# Altium project PROFINAL_BASE_DYCDE.PrjPcb
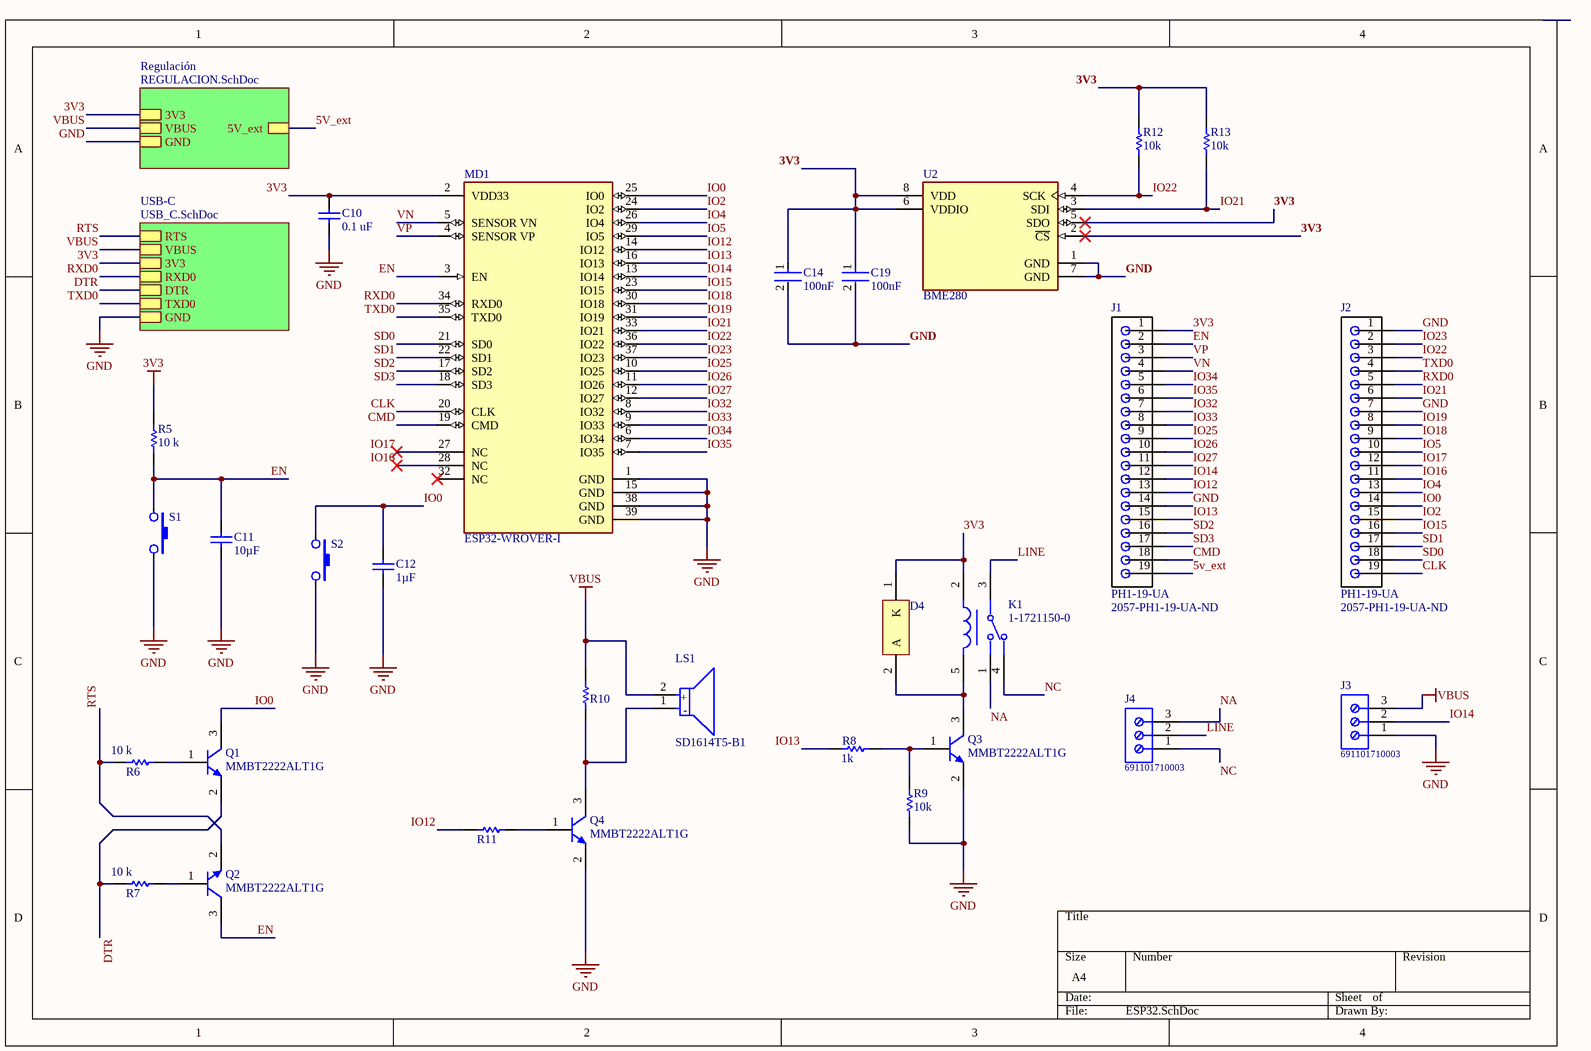
[diagram p0: ESP32.SchDoc]
3 sheets, 48 parts. Net scope: hierarchical (ports join the sheet entries above them; power ports are global).
Board files: PCB_V1.PcbDoc, PCB_v2.PcbDoc
Sheets:
  ESP32.SchDoc
    Regulación = REGULACION.SchDoc
    USB-C = USB_C.SchDoc

## Sheet ESP32.SchDoc
size A4; SheetNumber: 1; SheetTotal: 3

### Parts
C10  0.1 uF  [CAPC2013X94X50ML20T25]
C11  10µF  [CAPC2013X145X50ML20T25]
C12  1µF  [CAPC2013X145X50ML20T25]
C14  100nF  [FP-C0805C-DN-IPC_A]
C19  100nF  [FP-C0805C-DN-IPC_A]
D4  MBR120ESFT1G  [ONSC-SOD-123FL-2-498_V]  (value not drawn)
J1  PH1-19-UA  Supplier Part Number 1: 2057-PH1-19-UA-ND  [PH1-19-UA]
J2  PH1-19-UA  Supplier Part Number 1: 2057-PH1-19-UA-ND  [PH1-19-UA]
J3  691101710003  [691101710003]
J4  691101710003  [691101710003]
K1  1-1721150-0  [FP-1-1721150-0-MFG]
LS1  SD1614T5-B1  [FP-SD1614T5-B1-MFG]
MD1  ESP32-WROVER-I  [FP-ESP32-WROVER-I-MFG]
Q1  MMBT2222ALT1G  [ONSC-SOT-23-3-318-08_V]
Q2  MMBT2222ALT1G  [ONSC-SOT-23-3-318-08_V]
Q3  MMBT2222ALT1G  [ONSC-SOT-23-3-318-08_V]
Q4  MMBT2222ALT1G  [ONSC-SOT-23-3-318-08_V]
R5  10 k  [RESC2013X60X30ML20T20]
R6  10 k  [RESC2013X60X30ML20T20]
R7  10 k  [RESC2013X60X30ML20T20]
R8  1k  [RESC2013X60X30ML20T20]
R9  10k  [RESC2013X60X30ML20T20]
R10  ERJ-P06J102V  [RESC2013X70X40ML20T20]  (value not drawn)
R11  RK73B2ATTD103J  [RESC2013X60X30ML20T20]  (value not drawn)
R12  10k  [RESC2013X60X40ML20T25_A]
R13  10k  [RESC2013X60X40ML20T25_A]
S1  PTS820J25MSMTRLFS  [SMT_SW_PTS_820]  (value not drawn)
S2  IO0  [SMT_SW_PTS_820]  (value not drawn)
U2  BME280  [FP-BME280-MFG]

### Sub-sheets
Regulación = REGULACION.SchDoc: GND, 3V3, VBUS, 5V_ext
USB-C = USB_C.SchDoc: RTS, VBUS, 3V3, RXD0, DTR, TXD0, GND

### Nets
3V3: C10.2 C14.1 C19.1 D4.1(K) J1.1 K1.2 MD1.2(VDD33) R5.2 R12.2 R13.2 U2.2(~{CS}) U2.5(SDO) U2.6(VDDIO) U2.8(VDD) ; sheet Regulación/3V3, sheet USB-C/3V3
GND: C10.1 C11.1 C12.1 C14.2 C19.2 J1.14 J2.1 J2.7 J3.1 MD1.1(GND) MD1.15(GND) MD1.38(GND) MD1.39(GND) Q3.2(E) Q4.2(E) R9.2 S1.2 S2.2 U2.1(GND) U2.7(GND) ; sheet Regulación/GND, sheet USB-C/GND
VBUS: J3.3 LS1.2(A) R10.2 ; sheet Regulación/VBUS, sheet USB-C/VBUS
5v_ext: J1.19 ; sheet Regulación/5V_ext
CLK: J2.19 MD1.20(CLK)
CMD: J1.18 MD1.19(CMD)
DTR: Q1.2(E) R7.2 ; sheet USB-C/DTR
EN: C11.2 J1.2 MD1.3(EN) Q2.3(C) R5.1 S1.1
IO0: C12.2 J2.14 MD1.25(IO0) Q1.3(C) S2.1
IO2: J2.15 MD1.24(IO2)
IO4: J2.13 MD1.26(IO4)
IO5: J2.10 MD1.29(IO5)
IO12: J1.13 MD1.14(IO12) R11.1
IO13: J1.15 MD1.16(IO13) R8.1
IO14: J1.12 J3.2 MD1.13(IO14)
IO15: J2.16 MD1.23(IO15)
IO16: J2.11 MD1.28(NC)
IO17: J2.12 MD1.27(NC)
IO18: J2.9 MD1.30(IO18)
IO19: J2.8 MD1.31(IO19)
IO21: J2.6 MD1.33(IO21) R13.1 U2.3(SDI)
IO22: J2.3 MD1.36(IO22) R12.1 U2.4(SCK)
IO23: J2.2 MD1.37(IO23)
IO25: J1.9 MD1.10(IO25)
IO26: J1.10 MD1.11(IO26)
IO27: J1.11 MD1.12(IO27)
IO32: J1.7 MD1.8(IO32)
IO33: J1.8 MD1.9(IO33)
IO34: J1.5 MD1.6(IO34)
IO35: J1.6 MD1.7(IO35)
LINE: J4.2 K1.3
NA: J4.3 K1.1
NC: J4.1 K1.4
RTS: Q2.2(E) R6.2 ; sheet USB-C/RTS
RXD0: J2.5 MD1.34(RXD0) ; sheet USB-C/RXD0
SD0: J2.18 MD1.21(SD0)
SD1: J2.17 MD1.22(SD1)
SD2: J1.16 MD1.17(SD2)
SD3: J1.17 MD1.18(SD3)
TXD0: J2.4 MD1.35(TXD0) ; sheet USB-C/TXD0
VN: J1.4 MD1.5(SENSOR_VN)
VP: J1.3 MD1.4(SENSOR_VP)
NetD4_2: D4.2(A) K1.5 Q3.3(C)
NetLS1_1: LS1.1(C) Q4.3(C) R10.1
NetQ1_1: Q1.1(B) R6.1
NetQ2_1: Q2.1(B) R7.1
NetQ3_1: Q3.1(B) R8.2 R9.1
NetQ4_1: Q4.1(B) R11.2

Not connected (* = marked no-connect by the designer): MD1 32(NC)*

### Notes on the sheet
- (in symbol CMP-08413-000012-1) +; -

### Library data of the parts
C10 = CMP-2000-05016-1: Chip Capacitor, Ceramic, 0.1 uF, 10%, 50 V, 0805, RoHS, Tape and Reel; Manufacturer: AVX; Rated Voltage: 50V; Capacitance: 100nF; Dielectric: X7R; Case Size/Dimension: 0805; Tolerance (%): ±10%; Datasheet URL: http://www.farnell.com/datasheets/319609.pdf; Datasheet Version: Sep-07; Manufacturer URL: http://www.avx.com/
C11 C12 = CMP-2007-01082-1: 1µF ±10% 16V Ceramic Capacitor X7R 0805 (2012 Metric); Manufacturer: Kemet; Part Number: C0805C105K4RAC7800
C14 C19 = CMP-2007-00279-2: CAP CER 0.1UF 50V X7R 0805; Manufacturer Part Number: C0805C104K5RACTU; Manufacturer: KEMET; Value: 0.10 μF; Tolerance: 0.1; Temperature Coefficient: 30ppm/°C; Material: Ceramic; Device Class L2: Capacitors; Temperature Range Low: -55°C; Voltage Rating: 50 V; Digikey Description: CAP CER 0.1UF 50V X7R 0805; Category: Cap; ComponentLink2Description: Datasheet; Octopart: https://octopart.com/c0805c104k5ractu-kemet-143926; RoHS: TRUE; ComponentLink2URL: https://content.kemet.com/datasheets/KEM_C1003_C0G_SMD.pdf; Temperature Characteristic: X7R; Temperature: -55°C to +125°C; Height: 0.88mm; Temperature Range High: +125°C; Device Class L1: Passive Components; Automotive: No; Lead Free: Yes; Ipc Land Pattern Name: CAPC200125X78; Device Class L3: Ceramic Capacitors; Mouser Description: Cap Ceramic 0.1uF 50V X7R 10% SMD 2.0 x 1.2 mm 125 C Paper T/R; Capacitance: 0.10 μF; Package: C0805C-DN
D4 = CMP-1055-00434-1: Schottky Power Rectifier, 2-Pin SOD-123, Pb-Free, Tape and Reel; Manufacturer: On Semiconductor; Configuration: Single; IFSM Max (A): 40; ComponentLink2URL: http://www.onsemi.cn/pub_link/Collateral/MBR120ESFT1-D.PDF; PackageDescription: 2-Pin SOD, Body 1.65 x 2.7 mm; RoHS: TRUE; ComponentLink1URL: http://www.onsemi.com/; PackageVersion: Rev. D, 05/2013; PartNumber: MBR120ESFT1G; PackageReference: SOD-123FL-2-498; ComponentLink2Description: Datasheet; ComponentLink1Description: Manufacturer URL; DatasheetVersion: Rev. 4; ComponentLink3Description: Package Specification; ComponentLink3URL: http://www.onsemi.com/pub_link/Collateral/498-01.PDF; Mounting Technology: Surface Mount; Packing: Tape and Reel
J1 J2 = PH1-19-UA: Connector Header Through Hole 19 position 0.100" (2.54mm); Supplier 1: Digi-Key
J3 J4 = CMP-1502-03257-1: Series 101 - 5.00 mm Horizontal Entry Modular with Pressure Clamp WR-TBL, 3 pin; Manufacturer: Wurth Elektronik; Pitch: 5.00mm; Pin Number: 3; Publisher: WurthElektronik; Part Number: 691101710003; Operating Temperature: -40to105degC; Package Reference: 691101710003; Packaging: Box; Manufacturer URL: http://www.we-online.de; Datasheet URL: http://katalog.we-online.de/em/datasheet/6911017100xx.pdf; Mounting Technology: THT
K1 = CMP-03395-000112-1: RELAY GEN PURPOSE SPDT 10A 5V; Manufacturer: TE; Coil Power: 360mW; Coil Resistance: 70Ω; Coil Type: Non-Latching; Number Of Contacts: 1; Standoff Height: 0.2mm; Device Class L1: Electromechanical; Device Class L3: Power Relays; Throw Configuration: SPDT; ComponentLink2Description: Datasheet; RoHS: TRUE; Automotive: No; Octopart: https://octopart.com/1-1721150-0-te+connectivity-41294869; Switching Current: 10A; Ambient Temperature Range Low: -30°C; ComponentLink2URL: https://www.te.com/usa-en/product-1-1721150-0.html?te_bu=Cor&te_type=other&te_campaign=oct_glo_cor-oct-global-oth-prtnr-fy19-oct-octo-buy-bom_sma-298_2&elqCampaignId=35216; Package: 1-1721150-0; Height: 16.3mm; Lead Free: Yes; Manufacturer Part Number: 1-1721150-0; Digikey Description: RELAY GEN PURPOSE SPDT 10A 5V; Category: Relay; Ambient Temperature Range High: +70°C; Device Class L2: Relays; Current Rating: 10A; Coil Voltage: 5V
LS1 = CMP-08413-000012-1: AUDIO MAGNETIC XDCR 3-6V TH; Voltage Rating (DC): 5V; Frequency: 2.048kHz; Number of Terminals/Pins: 2; Max Supply Current: 80mA; Self Resonant Frequency: 2.05kHz; Washable: No; Diameter: 16mm; Package Quantity: 480; Min Operating Temperature: -10°C; Termination: PC Pins; Mount: Through Hole; Packaging: Tray; Height: 14mm; Series: SD; Operating Supply Current: 80mA; Operating Supply Voltage: 5V; Max Operating Temperature: 70°C; Number of Pins: 2; Sensing Method: Magnetic
MD1 = CMP-194065-000001-1: SMD MODULE, ESP32-D0WDQ6, 32MBIT; Manufacturer: Espressif; Number Of Adc Channels: 16; Min Supply Voltage: 2.3V; Interface: I2C,SPI,UART,I2S,Other; Max Frequency: 2484MHz; Nominal Supply Current: 500mA; Sensitivity: -98dBm; Max Supply Voltage: 3.6V; Number Of Gpio: 20; Data Rate: 150Mbits/s; Package: ESP32-WROVER-I; Temperature Range Low: -40°C; Temperature Range High: +85°C; Device Class L1: Integrated Circuits (ICs); Category: UNK; ComponentLink2Description: Datasheet; Device Class L2: RF Semiconductors and Devices; Automotive: No; Lead Free: Yes; Octopart: https://octopart.com/esp32-wrover-i-espressif+systems-89171349; ComponentLink2URL: https://www.espressif.com/sites/default/files/documentation/esp32-wrover_datasheet_en.pdf; Temperature: -40°C to +85°C; Height: 3.4mm; RoHS: TRUE; Digikey Description: SMD MODULE, ESP32-D0WDQ6, 32MBIT; Device Class L3: Transceivers; Manufacturer Part Number: ESP32-WROVER-I
Q1-Q4 = CMP-1048-00538-1: General Purpose Transistor, NPN Silicon, 3-Pin SOT-23, Pb-Free, Tape and Reel; Manufacturer: On Semiconductor; fT Min (MHz): 300; IC Continuous (A): 0.6; ComponentLink3URL: http://www.onsemi.cn/pub_link/Collateral/318-08.PDF; PartNumber: MMBT2222ALT1G; RoHS: TRUE; ComponentLink1URL: http://www.onsemi.com/; ComponentLink3Description: Package Specification; ComponentLink2Description: Datasheet; Mounting Technology: Surface Mount; Packing: Tape and Reel; PackageDescription: 3-Pin Small Outline Transistor, Body 2.92 x 1.3 mm, Pitch 0.95 mm; DatasheetVersion: Rev. 10; PackageReference: SOT-23-3-318-08; ComponentLink2URL: http://www.onsemi.cn/pub_link/Collateral/MMBT2222LT1-D.PDF; Polarity: NPN; PackageVersion: Rev. AP, 11/2009; ComponentLink1Description: Manufacturer URL
R5-R9 = CMP-2001-04657-1: 10 kOhms ±5% 0.25W, 1/4W Chip Resistor 0805 (2012 Metric) Automotive AEC-Q200, Moisture Resistant Thick Film; Part Number: RK73B2ATTD103J; Manufacturer: KOA Speer
R10 = CMP-2001-00477-1: RES SMD 1K OHM 5% 1/2W 0805; Manufacturer: Panasonic; Part Number: ERJ-P06J102V
R11 = CMP-2001-04657-1: 10 kOhms ±5% 0.25W, 1/4W Chip Resistor 0805 (2012 Metric) Automotive AEC-Q200, Moisture Resistant Thick Film; Manufacturer: KOA Speer; Part Number: RK73B2ATTD103J
R12 R13 = CMP-2001-00582-2: Metal Film Chip Resistor, High Reliability Type, 0.125 W, +/- 0.1%, -55 to 155 degC, 0805 (2012 Metric), RoHS, Tape and Reel; Voltage Rating: 100V; Power Rating: 125mW(1/8W); Brand: Panasonic; Temperature Coefficient: 25PPM/C; Resistance: 10kOhms; Product Category: ThinFilmResistors-SMD; Datasheet Version: 02/2016; Operating Temperature Range: -55Cto+155C; Length: 2mm; Mounting Technology: SurfaceMount; Manufacturer URL: http://www.panasonic.com/; Width: 1.25mm; Packaging: Reel; Product: ThinFilmResistorsSMD; Package / Case: 0805(2012metric); Termination Style: SMD/SMT; Tolerance: 0.1%; Datasheet URL: https://industrial.panasonic.com/cdbs/www-data/pdf/RDM0000/AOA0000C307.pdf; Package Description: 2-Pin Surface Mount Device, Body 2 x 1.25 mm; Factory Pack Quantity: 5000; Series: ERA-6A; Case Code - mm: 2012; RoHS: Details; Package Reference: 0805; Height: 0.5mm; Manufacturer: Panasonic; Case Code - in: 0805; Type: MetalFilmChipResistors
S2 = PTS820J25MSMTRLFS
U2 = CMP-2000-05073-3: SENSOR PRESSURE HUMIDITY TEMP; Sensor Type: Temperature; Accuracy: 3%; Response Time: 1s; Output Type: SPI; Min Operating Temperature: -40°C; Max Operating Temperature: 85°C; Case/Package: LGA; Packaging: Cut Tape; Mount: Surface Mount; Lead Free: Lead Free; Number of Pins: 8

## Sheet REGULACION.SchDoc
size A4; SheetNumber: 3; SheetTotal: 3
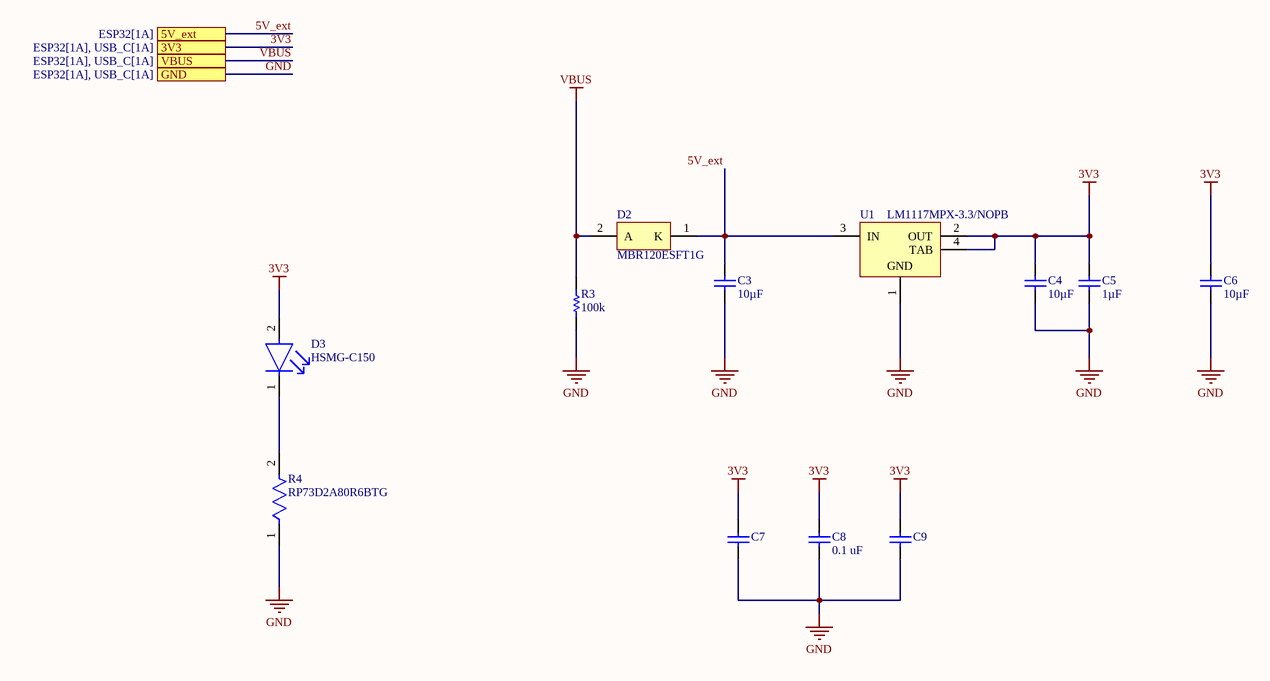
[diagram p1: REGULACION.SchDoc]

### Parts
C3  10µF  [CAPC2013X140X50ML20T25]
C4  10µF  [CAPC2013X140X50ML20T25]
C5  1µF  [CAPC2013X145X50ML20T25]
C6  10µF  [CAPC2013X140X50ML20T25]
C7  C0805C106K4PACTU  [CAPC2013X140X50ML20T25]  (value not drawn)
C8  0.1 uF  [CAPC2013X94X50ML20T25]
C9  C0805C106K4PACTU  [CAPC2013X140X50ML20T25]  (value not drawn)
D2  MBR120ESFT1G  [ONSC-SOD-123FL-2-498_V]
D3  HSMG-C150  [FP-HSMG-C150-MFG]
R3  100k  [RESC2013X60X40ML20T25]
R4  RP73D2A80R6BTG  [FP-RP732A-IPC_A]
U1  LM1117MPX-3.3/NOPB  [DCY0004A_M]

### Ports
3V3 (see ESP32[1A], USB_C[1A]), 5V_ext (see ESP32[1A]), GND (see ESP32[1A], USB_C[1A]), VBUS (see ESP32[1A], USB_C[1A])

### Nets
3V3: C4.2 C5.2 C6.2 C7.2 C8.2 C9.2 D3.2(A) U1.2(OUT) U1.4(TAB) ; port 3V3
GND: C3.1 C4.1 C5.1 C6.1 C7.1 C8.1 C9.1 R3.1 R4.1 U1.1(GND) ; port GND
VBUS: D2.2(A) R3.2 ; port VBUS
5v_ext: C3.2 D2.1(K) U1.3(IN) ; port 5V_ext
NetD3_1: D3.1(C) R4.2

### Library data of the parts
C3 C4 C6 C7 C9 = CMP-2007-03242-1: 10µF ±10% 16V Ceramic Capacitor X5R 0805 (2012 Metric); Part Number: CL21A106KOQNNNG
C5 = CMP-2007-01082-1: as C11 on sheet ESP32
C8 = CMP-2000-05016-1: as C10 on sheet ESP32; Case Size/Dimension: 0805; Tolerance (%): ±10%; Datasheet URL: http://www.farnell.com/datasheets/319609.pdf; Datasheet Version: Sep-07; Manufacturer URL: http://www.avx.com/
D2 = CMP-1055-00434-1: as D4 on sheet ESP32; ComponentLink2URL: http://www.onsemi.cn/pub_link/Collateral/MBR120ESFT1-D.PDF; PackageDescription: 2-Pin SOD, Body 1.65 x 2.7 mm; RoHS: TRUE; ComponentLink1URL: http://www.onsemi.com/; PackageVersion: Rev. D, 05/2013; PartNumber: MBR120ESFT1G; PackageReference: SOD-123FL-2-498; ComponentLink2Description: Datasheet; ComponentLink1Description: Manufacturer URL; DatasheetVersion: Rev. 4; ComponentLink3Description: Package Specification; ComponentLink3URL: http://www.onsemi.com/pub_link/Collateral/498-01.PDF; Mounting Technology: Surface Mount; Packing: Tape and Reel
D3 = CMP-2000-05061-2: LED GREEN DIFFUSED 1206 SMD; Manufacturer: Broadcom; Led Orientation: Top View; Max Junction Temp: +95°C; Peak Emmision Wavelength: 570nm; Viewing Angle: 170°; Wavelength: 572nm; Reverse Voltage: 5V; Luminous Intensity: 15mcd; Forward Voltage: 2.2V; Power Dissipation: 65mW; Forward Current: 20mA; ComponentLink2Description: Datasheet; Lead Free: Yes; Temperature Range Low: -40°C; Package: HSMG-C150; Digikey Description: LED GREEN DIFFUSED 1206 SMD; Mouser Description: LED Uni-Color Green 570nm 2-Pin Chip LED T/R; Manufacturer Part Number: HSMG-C150; Temperature Range High: +85°C; Device Class L1: Optoelectronics; Colour: Green; Category: Diode; Device Class L3: unset; RoHS: TRUE; Height: 1.2mm; ComponentLink2URL: https://docs.broadcom.com/docs/AV02-0551EN; Device Class L2: LEDs; Automotive: No; Ipc Land Pattern Name: DIOCP320160X55; Octopart: https://octopart.com/hsmg-c150-broadcom-71131304; Temperature: -40°C to +85°C
R3 = CMP-2001-00583-1: 100 kOhms ±0.1% 0.125W, 1/8W Chip Resistor 0805 (2012 Metric) Automotive AEC-Q200 Thin Film; Part Number: ERA6AEB104V; Manufacturer: Panasonic
R4 = CMP-03211-002377-1: RESISTOR, 0805 80.6Ω, 0.1% 15ppm/°C; Manufacturer: TE Connectivity; Power Rating: 0.125W; Voltage Rating: 150V; ComponentLink2URL: https://www.te.com/commerce/DocumentDelivery/DDEController?Action=srchrtrv&DocNm=1773272&DocType=DS&DocLang=English; Device Class L3: Chip SMD Resistors; Automotive: No; ComponentLink2Description: Datasheet; Series: RP73; Temperature Coefficient: 15ppm/°C; Octopart: https://octopart.com/rp73d2a80r6btg-te+connectivity-42011633; octopart_url: https://octopart.com/rp73d2a80r6btg-te+connectivity-42011633; Device Class L2: Resistors; Device Class L1: Passive Components; Value: 80.6Ω; Composition: Thin Film; Lead Free: Yes; Ipc Land Pattern Name: RESC200125X55; Resistance: 80.6Ω; Package: RP732A; packaging: 250 cut tape length; Height: 0.65mm; Tolerance: 0.1%; Manufacturer Part Number: RP73D2A80R6BTG; Temperature: -55°C to 155°C; Temperature Range High: 155°C; RoHS: TRUE; Category: Res; Temperature Range Low: -55°C
U1 = CMP-0062-01639-4: 800mA Low-Dropout Linear Regulator, 4-pin SOT-223, Pb-Free; Manufacturer: Texas Instruments; High-Reliability: Y; PowerWise: N; PackageTopMarking: XYTT*N05A; CompType: LDO IC; ComponentLink1URL: http://www.ti.com/general/docs/lit/getliterature.tsp?genericPartNumber=LM1117-N&fileType=pdf; PartNumber: LM1117MPX-3.3/NOPB; ComponentLink1Description: Datasheet URL; PinCount: 4; Code_JEDEC: TO-261-AA; PackageDescription: Molded SOT-223, 6.50 x 3.56 x 1.6mm Body, 4 Lead, 2.3mm Pitch; PackageReference: DCY0004A; RoHS: Y; Code_IPC: SOT223-4

## Sheet USB_C.SchDoc
size A4; SheetNumber: 2; SheetTotal: 3
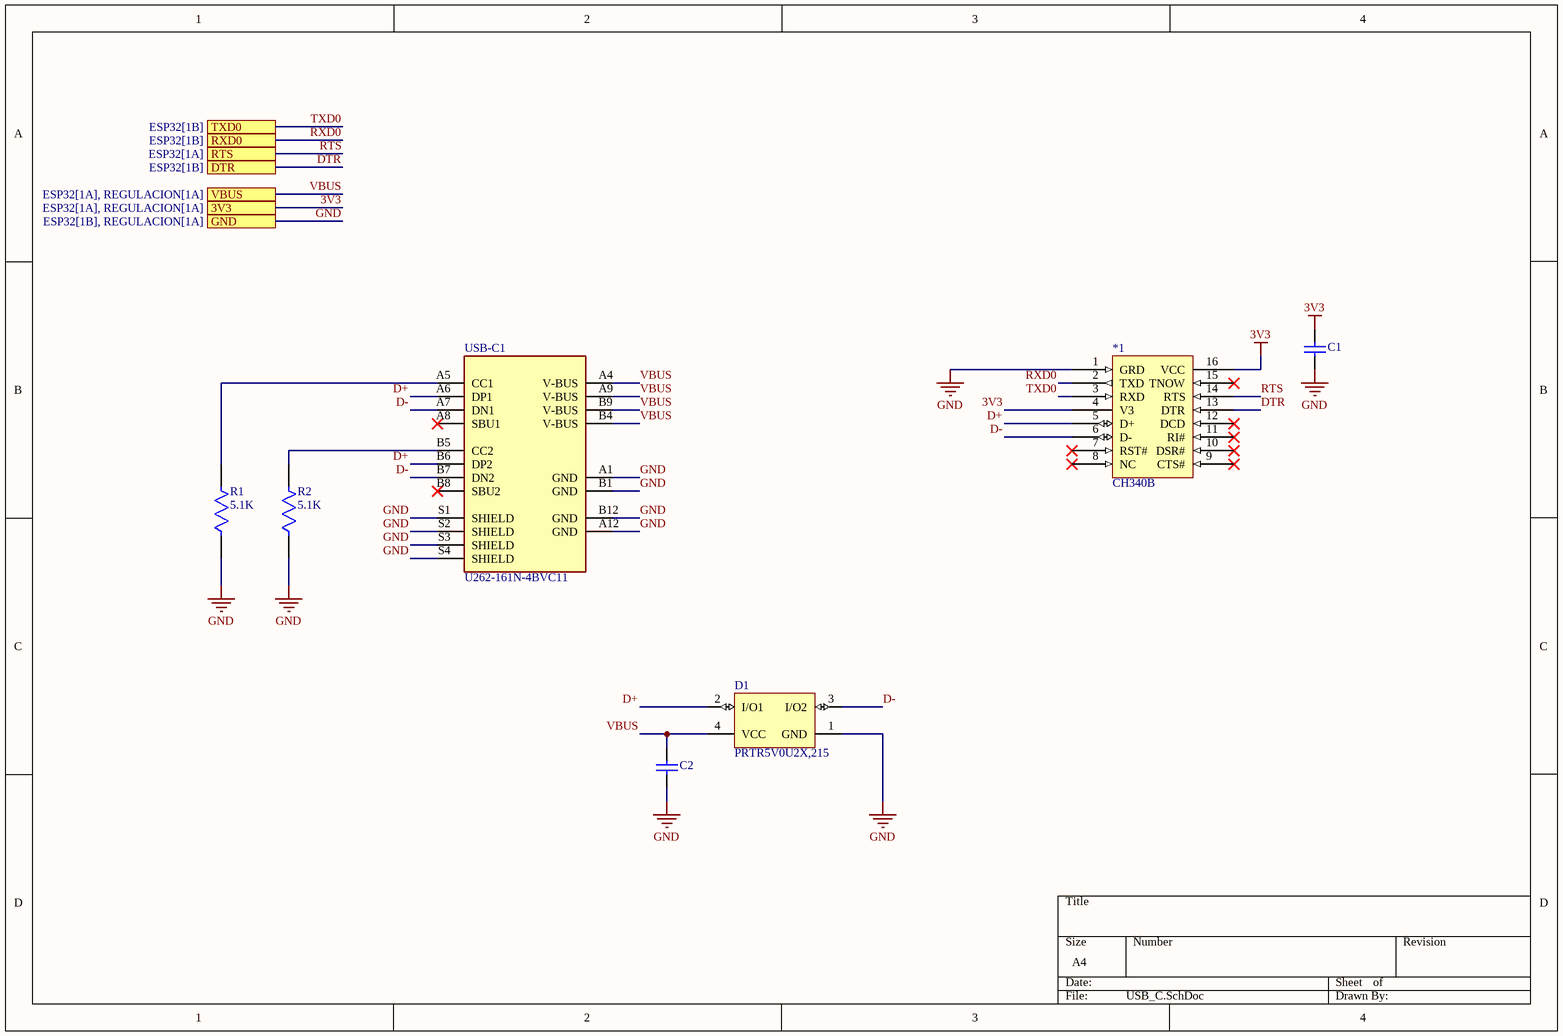
[diagram p2: USB_C.SchDoc]

### Parts
*1  CH340B  [CH340B]
C1  08055C104KAT2A  [CAPC2013X94X50ML20T25]  (value not drawn)
C2  08055C104KAT2A  [CAPC2013X94X50ML20T25]  (value not drawn)
D1  PRTR5V0U2X,215  [NXP-SOT143B-4_V]
R1  5.1K  [FP-CRCW0805-e3-IPC_A]
R2  5.1K  [FP-CRCW0805-e3-IPC_A]
USB-C1  U262-161N-4BVC11  [U262-161N-4BVC11]

### Ports
3V3 (see ESP32[1A], REGULACION[1A]), DTR (see ESP32[1B]), GND (see ESP32[1B], REGULACION[1A]), RTS (see ESP32[1A]), RXD0 (see ESP32[1B]), TXD0 (see ESP32[1B]), VBUS (see ESP32[1A], REGULACION[1A])

### Nets
3V3: *1.4(V3) *1.16(VCC) C1.2 ; port 3V3
GND: *1.1(GRD) C1.1 C2.1 D1.1(GND) R1.1 R2.1 USB-C1.A1(GND) USB-C1.A12(GND) USB-C1.B1(GND) USB-C1.B12(GND) USB-C1.S1(SHIELD) USB-C1.S2(SHIELD) USB-C1.S3(SHIELD) USB-C1.S4(SHIELD) ; port GND
VBUS: C2.2 D1.4(VCC) USB-C1.A4(V-BUS) USB-C1.A9(V-BUS) USB-C1.B4(V-BUS) USB-C1.B9(V-BUS) ; port VBUS
D+: *1.5(D+) D1.2(I/O1) USB-C1.A6(DP1) USB-C1.B6(DP2)
D-: *1.6(D-) D1.3(I/O2) USB-C1.A7(DN1) USB-C1.B7(DN2)
DTR: *1.13(DTR) ; port DTR
RTS: *1.14(RTS) ; port RTS
RXD0: *1.2(TXD) ; port RXD0
TXD0: *1.3(RXD) ; port TXD0
NetR1_2: R1.2 USB-C1.A5(CC1)
NetR2_2: R2.2 USB-C1.B5(CC2)

Not connected (* = marked no-connect by the designer): *1 7(RST#)* 8(NC)* 9(CTS#)* 10(DSR#)* 11(RI#)* 12(DCD)* 15(TNOW)*; USB-C1 A8(SBU1)* B8(SBU2)*

### Library data of the parts
*1 = CH340B: - USB 2.0 Transceiver 2Mbps SOP-16_150mil USB ICs ROHS; ComponentLink1Description: Datasheet; ComponentLink1URL: https://www.mpja.com/download/35227cpdata.pdf
C1 C2 = CMP-2000-05016-1: as C10 on sheet ESP32; Case Size/Dimension: 0805; Tolerance (%): ±10%; Datasheet URL: http://www.farnell.com/datasheets/319609.pdf; Datasheet Version: Sep-07; Manufacturer URL: http://www.avx.com/
D1 = CMP-2000-05285-1: Ultra Low Capacitance Double Rail-to-Rail ESD Protection Diode, 5.5 V, 1 pF, -40 to 85 degC, 4-Pin SOT143B, RoHS, Tape and Reel; Manufacturer: NXP Semiconductors; Capacitance Value: 16pF; Number of Elements: 1; Rad Hardened: No; Reverse Breakdown Voltage: 6V; Working Voltage (Max): 5.5V; Polarity: Uni-Directional; Configuration: Quad; Leakage Current: 0.1uA; Product Height (mm): 1mm; Suppressor Type: DiodeArrays; Product Length (mm): 3mm; Product Depth (mm): 1.4mm; ESD Protection Voltage: 8KV@ContactDisc; Package Type: SOT; Mounting: SurfaceMount; Packaging: TapeandReel; Datasheet Version: Rev. 02, 01/2008; Reverse Stand-off Voltage: 5.5V; Manufacturer URL: http://www.nxp.com/; Operating Temp Range: -40Cto85C; Operating Temperature Classification: Industrial; Working Voltage: 5.5V; Operating Temperature Min Deg. C: -40C; Datasheet URL: https://datasheet.ciiva.com/4479/prtr5v0u2x-102853-4479461.pdf; Leakage Current (Max): 0.1uA; Direction Type: Uni-Directional; Pin Count: 3+Tab; Operating Temperature Max Deg. C: 85C; Mounting Style: SurfaceMount; Package / Case: SOT
R1 R2 = CMP-2001-04024-2: RES Thick Film, 5.1kΩ, 1%, 0.125W, 100ppm/°C, 0805; Power Rating: 125mW; Voltage Rating (DC): 150V; Resistance: 5.1kR; Packaging: Tape and Reel; Case Code (Metric): 2012; Contact Plating: Tin; Case Code (Imperial): 0805; Depth: 1.25mm; Tolerance: 1%; Width: 0.049inch; Temperature Coefficient: 100ppm/°C; Max Power Dissipation: 125mW; Military Standard: Not; Lead Free: Lead Free; Mount: Surface Mount; Min Operating Temperature: -55°C; Package Quantity: 10; Weight: 0.000194oz; Height: 0.45mm; Number of Terminations: 2; Max Operating Temperature: 155°C; Termination: SMD/SMT; Case/Package: 0805; Composition: Thick Film; Voltage Rating: 150V; Length: 2mm; Features: Automotive AEC-Q200; Radiation Hardening: No
USB-C1 = U262-161N-4BVC11: USB - Type C Female 16 SMT USB Connectors RoHS; ComponentLink1Description: datasheet; ComponentLink1URL: https://datasheet.lcsc.com/szlcsc/2002271811_XKB-Connectivity-U262-161N-4BVC11_C319148.pdf; ComponentLink2Description: LCSC Link; ComponentLink2URL: https://lcsc.com/product-detail/USB-Connectors_XKB-Connectivity-U262-161N-4BVC11_C319148.html

## Nets that join several sheets
3V3: ESP32 (14 pins), REGULACION (9 pins), USB_C (*1.4 *1.16 C1.2)
GND: ESP32 (20 pins), REGULACION (10 pins), USB_C (14 pins)
VBUS: ESP32 (J3.3 LS1.2 R10.2), REGULACION (D2.2 R3.2), USB_C (6 pins)
5v_ext: ESP32 (J1.19), REGULACION (C3.2 D2.1 U1.3)
DTR: ESP32 (Q1.2 R7.2), USB_C (*1.13)
RTS: ESP32 (Q2.2 R6.2), USB_C (*1.14)
RXD0: ESP32 (J2.5 MD1.34), USB_C (*1.2)
TXD0: ESP32 (J2.4 MD1.35), USB_C (*1.3)